# EAGLE design BrainTrainer (EAGLE 7.2.0)
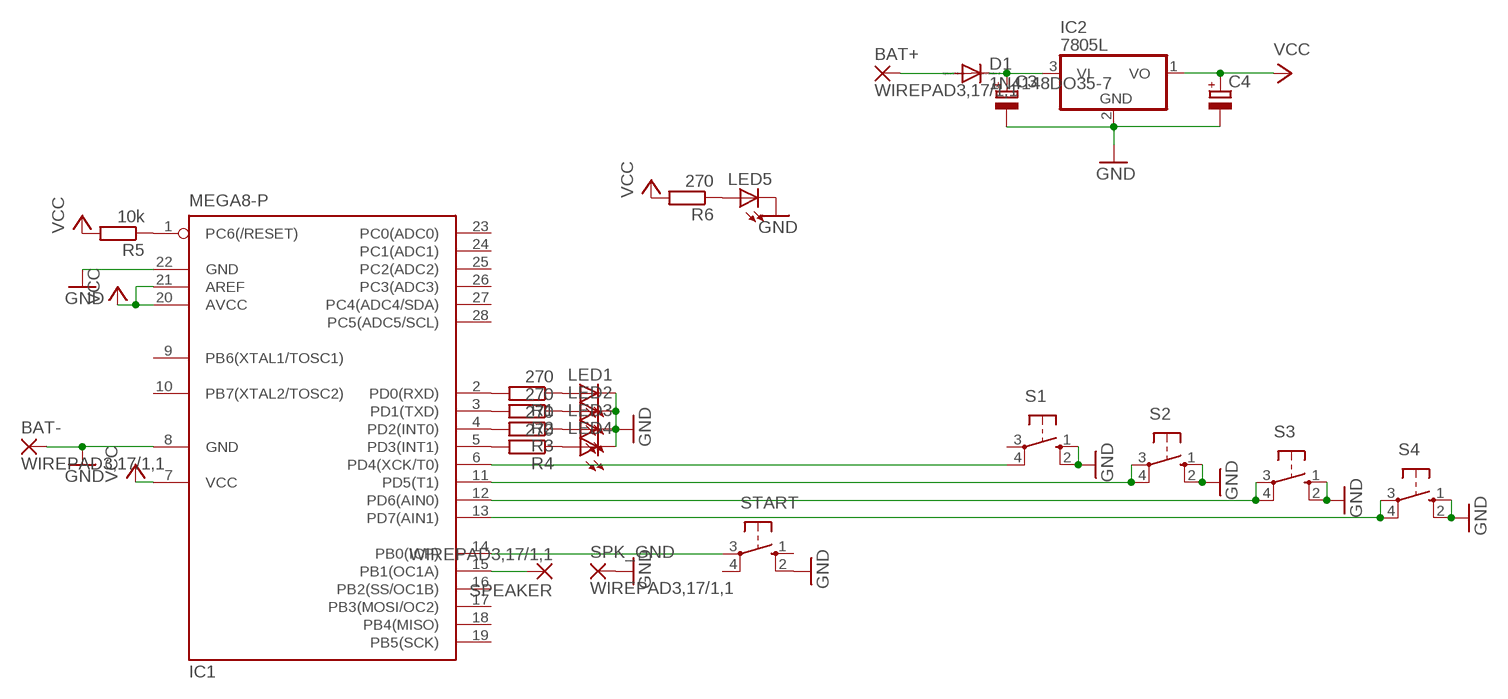
[diagram p0: schematic, sheet 1]

## Parts
BAT+  WIREPAD3,17/1,1  [3,17/1,1]
BAT-  WIREPAD3,17/1,1  [3,17/1,1]
C3  CPOL-EUE2,5-6E  [E2,5-6E]
C4  CPOL-EUE2,5-6E  [E2,5-6E]
D1  1N4148DO35-7  [DO35-7]
IC1  MEGA8-P  [DIL28-3]
IC2  7805L  [TO92]
LED1  LED5MM  [LED5MM]
LED2  LED5MM  [LED5MM]
LED3  LED5MM  [LED5MM]
LED4  LED5MM  [LED5MM]
LED5  LED5MM  [LED5MM]
R1  270  R-EU_0207/7  [0207/7]
R2  270  R-EU_0207/7  [0207/7]
R3  270  R-EU_0207/7  [0207/7]
R4  270  R-EU_0207/7  [0207/7]
R5  10k  R-EU_0207/7  [0207/7]
R6  270  R-EU_0207/7  [0207/7]
S1  10-XX  [B3F-10XX]
S2  10-XX  [B3F-10XX]
S3  10-XX  [B3F-10XX]
S4  10-XX  [B3F-10XX]
SPEAKER  WIREPAD3,17/1,1  [3,17/1,1]
SPK_GND  WIREPAD3,17/1,1  [3,17/1,1]
START  10-XX  [B3F-10XX]

## Nets
GND: BAT-.1(P) C3.- C4.- IC1.8(GND) IC1.22(GND) IC2.2(GND) LED1.K(C) LED2.K(C) LED3.K(C) LED4.K(C) LED5.K(C) S1.1(S) S1.2(S1) S2.1(S) S2.2(S1) S3.1(S) S3.2(S1) S4.1(S) S4.2(S1) SPK_GND.1(P) START.2(S1)
N$1: IC1.15(PB1(OC1A)) SPEAKER.1(P)
N$2: IC1.2(PD0(RXD)) R1.2
N$3: LED1.A R1.1
N$4: IC1.3(PD1(TXD)) R2.2
N$5: LED2.A R2.1
N$6: IC1.4(PD2(INT0)) R3.2
N$7: LED3.A R3.1
N$8: IC1.5(PD3(INT1)) R4.2
N$9: IC1.6(PD4(XCK/T0)) S1.4(P1)
N$10: IC1.11(PD5(T1)) S2.3(P) S2.4(P1)
N$11: IC1.12(PD6(AIN0)) S3.3(P) S3.4(P1)
N$12: IC1.13(PD7(AIN1)) S4.3(P) S4.4(P1)
N$13: BAT+.1(P) D1.A
N$14: IC1.14(PB0(ICP)) START.3(P)
N$15: LED4.A R4.1
N$16: C3.+ D1.C IC2.3(VI)
N$17: IC1.1(PC6(/RESET)) R5.1
N$18: LED5.A R6.1
VCC: C4.+ IC1.7(VCC) IC1.20(AVCC) IC1.21(AREF) IC2.1(VO) R5.2 R6.2
Unconnected: IC1.9(PB6(XTAL1/TOSC1)) IC1.10(PB7(XTAL2/TOSC2)) IC1.16(PB2(SS/OC1B)) IC1.17(PB3(MOSI/OC2)) IC1.18(PB4(MISO)) IC1.19(PB5(SCK)) IC1.23(PC0(ADC0)) IC1.24(PC1(ADC1)) IC1.25(PC2(ADC2)) IC1.26(PC3(ADC3)) IC1.27(PC4(ADC4/SDA)) IC1.28(PC5(ADC5/SCL)) S1.3(P) START.1(S) START.4(P1)

## Library data of the parts
BAT+ BAT- SPEAKER SPK_GND = wirepad:WIREPAD: Wire PAD connect wire on PCB
C3 C4 = rcl:CPOL-EU: POLARIZED CAPACITOR, European symbol
D1 = diode:1N4148: DIODE high speed (Philips)
IC1 = atmel:MEGA8-P: MICROCONTROLLER 8 Kbytes FLASH, 1 kbytes SRAM, 512 bytes EEPROM, USART, 4-channel 10 bit ADC, 2-channel 8 bit ADC Pin compatible with Atmega48, ATMega88, ATMega168 Source: avr.lbr; OC_FARNELL: unknown; OC_NEWARK: unknown
IC2 = linear:78*: Positive VOLTAGE REGULATOR Source: http://cache.national.com/ds/LM/LM78L05.pdf http://www.fairchildsemi.com/ds/LM/LM7805.pdf
LED1-LED5 = led:LED: LED OSRAM: - CHIPLED LG R971, LG N971, LY N971, LG Q971, LY Q971, LO R971, LY R971 LH N974, LH R974 LS Q976, LO Q976, LY Q976 LO Q996 - Hyper CHIPLED LW Q18S LB Q993, LB Q99A, LB R99A - SideLED LS A670, LO A670, LY A670, LG A670, LP A670 LB A673, LV A673, LT A673, LW A673 LH A674 LY A675 LS A676, LA A676, LO A676, LY A676, LW A676 LS A679, LY A679, LG A679 - Hyper Micro SIDELED® LS Y876, LA Y876, LO Y876, LY Y876 LT Y87S - SmartLED LW L88C, LW L88S LB L89C, LB L89S, LG L890 LS L89K, LO L89K, LY L89K LS L896, LA L896, LO L896, LY L896 - TOPLED LS T670, LO T670, LY T670, LG T670, LP T670 LSG T670, LSP T670, LSY T670, LOP T670, LYG T670 LG T671, LOG T671, LSG T671 LB T673, LV T673, LT T673, LW T673 LH T674 LS T676, LA T676, LO T676, LY T676, LB T676, LH T676, LSB T676, LW T676 LB T67C, LV T67C, LT T67C, LS T67K, LO T67K, LY T67K, LW E67C LS E67B, LA E67B, LO E67B, LY E67B, LB E67C, LV E67C, LT E67C LW T67C LS T679, LY T679, LG T679 LS T770, LO T770, LY T770, LG T770, LP T770 LB T773, LV T773, LT T773, LW T773 LH T774 LS E675, LA E675, LY E675, LS T675 LS T776, LA T776, LO T776, LY T776, LB T776 LHGB T686 LT T68C, LB T68C - Hyper Mini TOPLED® LB M676 - Mini TOPLED Santana® LG M470 LS M47K, LO M47K, LY M47K Source: http://www.osram.convergy.de LUXEON: - LUMILED® LXK2-PW12-R00, LXK2-PW12-S00, LXK2-PW14-U00, LXK2-PW14-V00 LXK2-PM12-R00, LXK2-PM12-S00, LXK2-PM14-U00 LXK2-PE12-Q00, LXK2-PE12-R00, LXK2-PE12-S00, LXK2-PE14-T00, LXK2-PE14-U00 LXK2-PB12-K00, LXK2-PB12-L00, LXK2-PB12-M00, LXK2-PB14-N00, LXK2-PB14-P00, LXK2-PB14-Q00 LXK2-PR12-L00, LXK2-PR12-M00, LXK2-PR14-Q00, LXK2-PR14-R00 LXK2-PD12-Q00, LXK2-PD12-R00, LXK2-PD12-S00 LXK2-PH12-R00, LXK2-PH12-S00 LXK2-PL12-P00, LXK2-PL12-Q00, LXK2-PL12-R00 Source: www.luxeon.com KINGBRIGHT: KA-3528ASYC Source: www.kingbright.com
R1-R6 = rcl:R-EU_: RESISTOR, European symbol
S1-S4 START = switch-omron:10-XX: OMRON SWITCH; MPN: B3F-1000; OC_FARNELL: 176432; OC_NEWARK: 36M3542

## Board
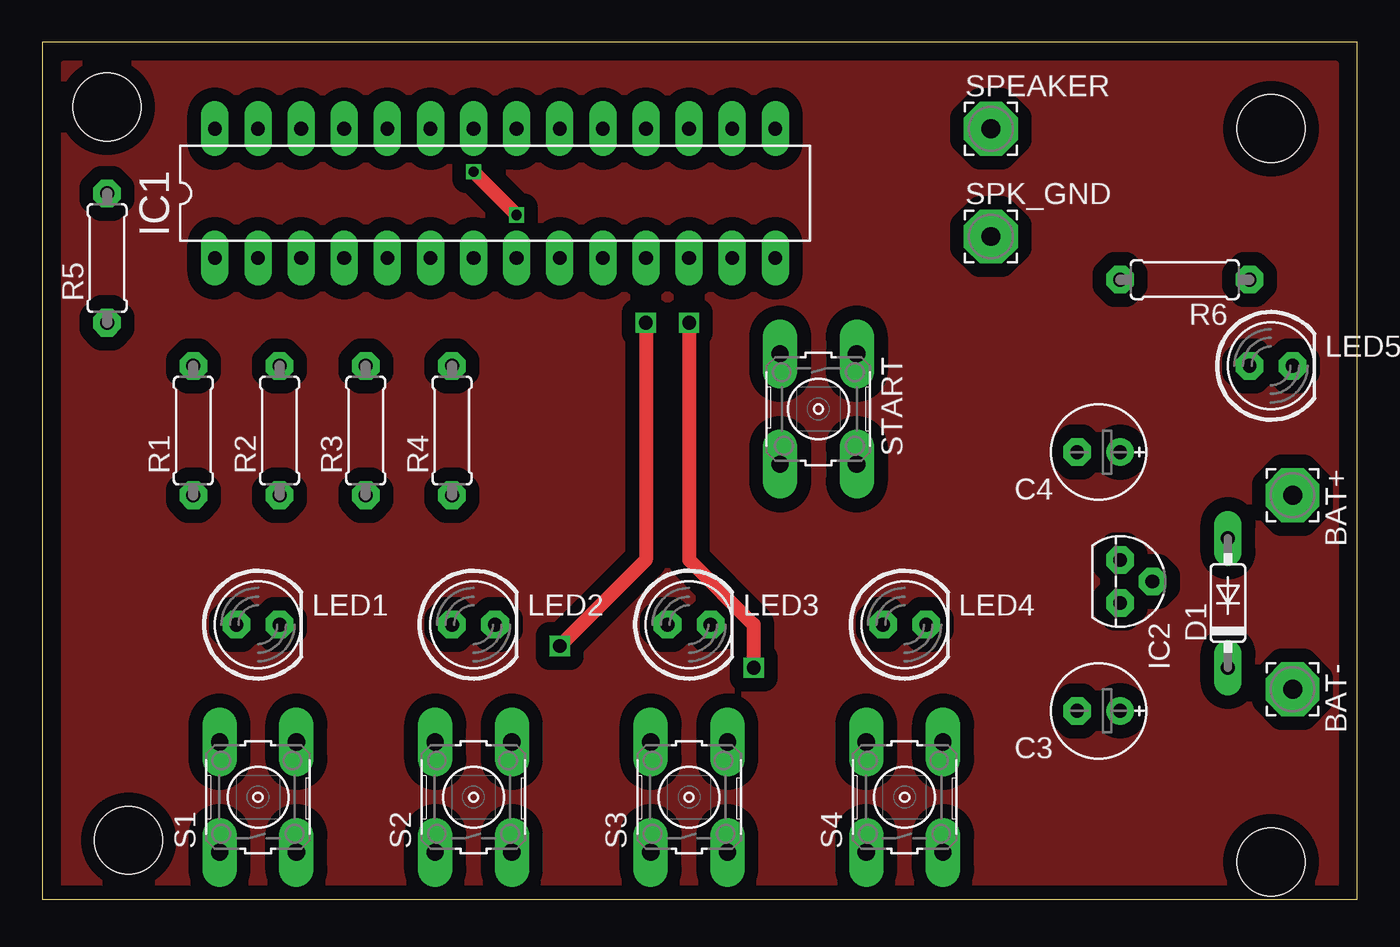
[diagram p1: board, top side]
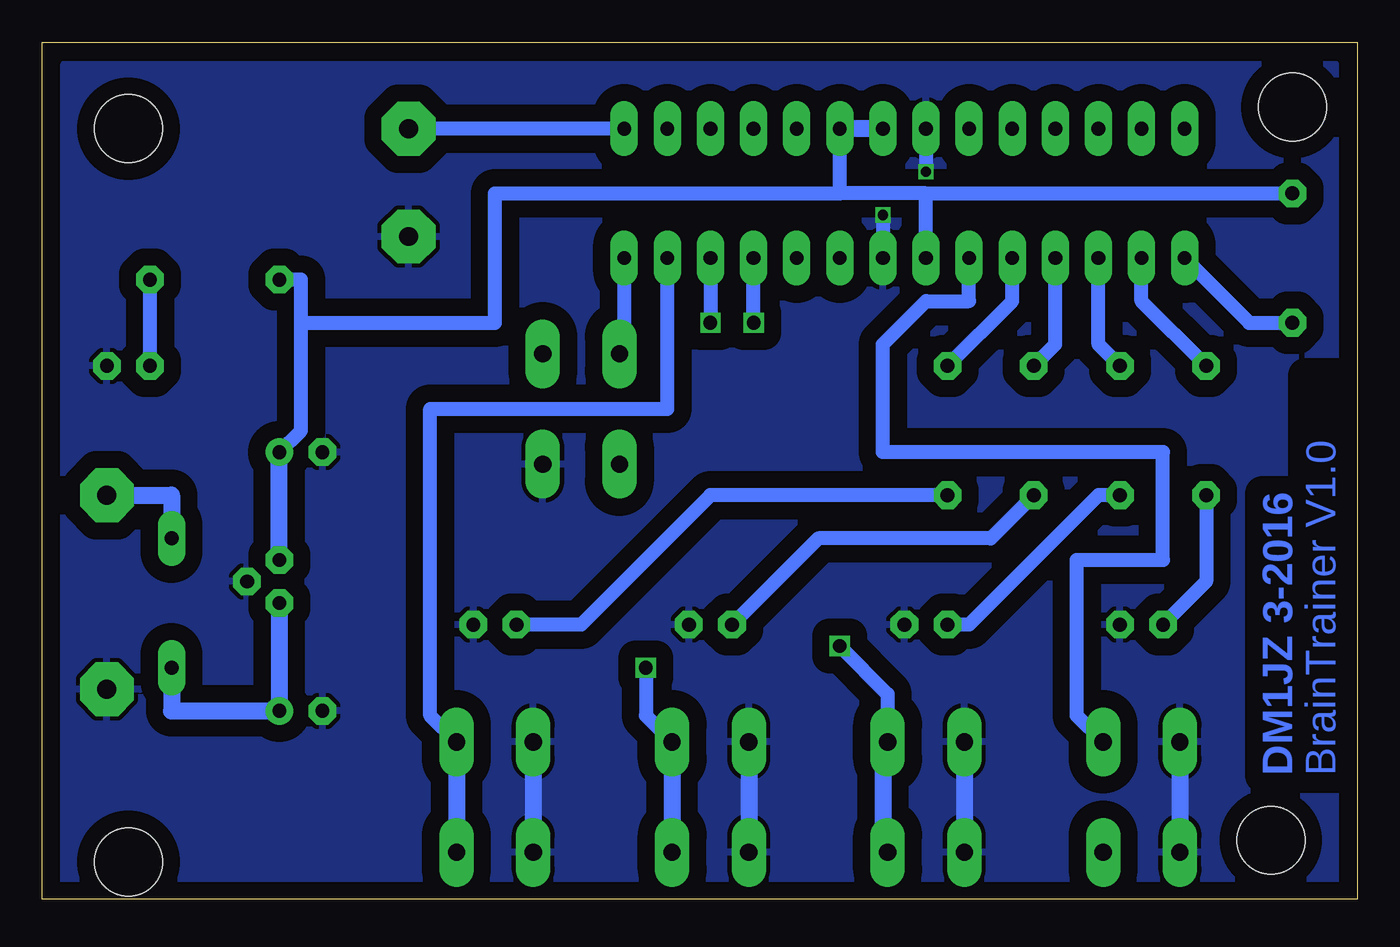
[diagram p2: board, bottom side, seen from below]

Size 77.46 x 50.47 mm. Coordinates in mm from the lower left corner, seen from the top.
Outline: 0,50.47 0,0 77.46,0 77.46,50.47 0,50.47
Copper layers (1*16): Top 0.035mm / dielectric 1.5mm / Bottom 0.035mm
Design rules "EagleRules *": minimum track width 7mil, minimum drill 12mil, track to track 7mil, track to pad 7mil, pad to pad 7mil, via to via 7mil, smd to smd 0mil, copper to edge 20mil, drill to drill 10mil, minimum pad ring 10mil, minimum via ring 6mil, stop-mask expansion 2mil, vias tented up to drill 25mil, thermal gap 10mil
Holes 3.99 mm at 3.81,46.66 5.08,3.48 72.39,2.21 72.39,45.39

### Footprints (pad centres in the part's own frame; a part is rotated, then mirrored left to right if it is on the bottom)
3,17/1,1 = drill 1.118 pad 3.175 octagon: 1 0,0
E2,5-6E = drill 0.813 pad 1.575: + -1.27,0 | drill 0.813 pad 1.575 octagon: - 1.27,0
DO35-7 = drill 0.813 long: A 3.81,0; C -3.81,0
DIL28-3 = drill 0.813 long: 1 -16.51,-3.81; 2 -13.97,-3.81; 3 -11.43,-3.81; 4 -8.89,-3.81; 5 -6.35,-3.81; 6 -3.81,-3.81; 7 -1.27,-3.81; 8 1.27,-3.81; 9 3.81,-3.81; 10 6.35,-3.81; 11 8.89,-3.81; 12 11.43,-3.81; 13 13.97,-3.81; 14 16.51,-3.81; 15 16.51,3.81; 16 13.97,3.81; 17 11.43,3.81; 18 8.89,3.81; 19 6.35,3.81; 20 3.81,3.81; 21 1.27,3.81; 22 -1.27,3.81; 23 -3.81,3.81; 24 -6.35,3.81; 25 -8.89,3.81; 26 -11.43,3.81; 27 -13.97,3.81; 28 -16.51,3.81
TO92 = drill 0.813 octagon: 1 -1.27,0; 2 0,1.905; 3 1.27,0
LED5MM = drill 0.813 octagon: A -1.27,0; K 1.27,0
0207/7 = drill 0.813 octagon: 1 -3.81,0; 2 3.81,0
B3F-10XX = drill 1.016 long: 1 -3.251,2.261; 2 3.251,2.261; 3 -3.251,-2.261; 4 3.251,-2.261

### Placement (x,y rotation side)
BAT+  73.66,23.8 270 top
BAT-  73.66,12.37 270 top
C3  62.23,11.1 180 top
C4  62.23,26.34 180 top
D1  69.85,17.45 90 top
IC1  26.67,41.58 0 top
IC2  63.5,18.72 270 top
LED1  12.7,16.18 0 top
LED2  25.4,16.18 0 top
LED3  38.1,16.18 0 top
LED4  50.8,16.18 0 top
LED5  72.39,31.42 0 top
R1  8.89,27.61 90 top
R2  13.97,27.61 90 top
R3  19.05,27.61 90 top
R4  24.13,27.61 90 top
R5  3.81,37.77 90 top
R6  67.31,36.5 180 top
S1  12.7,6.02 90 top
S2  25.4,6.02 90 top
S3  38.1,6.02 90 top
S4  50.8,6.02 90 top
SPEAKER  55.88,45.39 0 top
SPK_GND  55.88,39.04 0 top
START  45.72,28.88 270 top

### Tracks (layer width: path | path; a pad name or v marks a point on that pad's centre or on a via)
GND  (via drill 0.6)
  Top 0.813: v25.4,42.85 v27.94,40.31
  Bottom 0.813: IC1.22 v25.4,42.85 | v27.94,40.31 IC1.8
  Bottom 1.016: S1.2 S1.1 | S2.2 S2.1 | S3.2 S3.1 | S4.2 S4.1
  pour Bottom (isolate 1.016): 76.2,49.2 1.27,49.2 1.27,0.94 76.2,0.94
N$1
  Bottom 0.813: IC1.15 SPEAKER.1
N$2
  Bottom 0.813: R1.2 12.7,35.23 IC1.2
N$3
  Bottom 0.813: R1.1 8.89,18.72 LED1.A
N$4
  Bottom 0.813: R2.2 15.24,32.69 IC1.3
N$5
  Bottom 0.813: R2.1 15.24,23.8 22.86,16.18 LED2.A
N$6
  Bottom 0.813: R3.2 17.78,32.69 IC1.4
N$7
  Bottom 0.813: R3.1 21.59,21.26 31.75,21.26 LED3.A
N$8
  Bottom 0.813: R4.2 20.32,35.23 IC1.5
N$9
  Bottom 0.813: S1.4 16.51,10.82 16.51,19.99 11.43,19.99 11.43,26.34 27.94,26.34 27.94,32.69 25.4,35.23 22.86,35.23 IC1.6
N$10  (via drill 0.8)
  Top 0.813: v35.56,33.96 35.56,19.99 v30.48,14.91
  Bottom 0.813: v30.48,14.91 27.66,12.09 S2.4 | v35.56,33.96 IC1.11
  Bottom 1.016: S2.4 27.94,9.27 27.94,3.48 27.66,3.48 S2.3
N$11  (via drill 0.8)
  Top 0.813: v38.1,33.96 38.1,19.99 41.91,16.18 v41.91,13.64
  Bottom 0.813: IC1.12 v38.1,33.96 | v41.91,13.64 41.91,10.82 S3.4
  Bottom 1.016: S3.4 S3.3
N$12
  Bottom 0.813: S4.4 54.61,10.82 54.61,28.88 40.64,28.88 IC1.13
  Bottom 1.016: S4.4 S4.3
N$13
  Bottom 1.016: BAT+.1 69.85,23.8 D1.A
N$14
  Bottom 0.813: IC1.14 43.18,32.41 START.3
N$15
  Bottom 0.813: R4.1 38.1,23.8 45.72,16.18 LED4.A
N$16
  Bottom 1.016: D1.C 69.85,11.1 C3.+ IC2.3
N$17
  Bottom 0.813: IC1.1 6.35,33.96 R5.1
N$18
  Bottom 0.813: LED5.A R6.1
N$19
  pour Top (isolate 0.813): 1.27,49.2 1.27,0.94 76.2,0.94 76.2,49.2 69.85,49.2
VCC
  Bottom 0.813: C4.+ 62.23,27.61 62.23,33.96 | 62.23,33.96 50.8,33.96 50.8,41.58 30.48,41.58 | 30.48,41.58 IC1.20 | IC1.7 25.4,41.58 | 25.4,41.58 30.48,41.58 | 25.4,41.58 R5.2 | 62.23,33.96 62.23,36.5 R6.2
  Bottom 1.016: IC2.1 C4.+ | IC1.21 IC1.20

### Text on the board
Bottom: BrainTrainer V1.0 | DM1JZ 3-2016